# Altium schematic sheet MCU.SchDoc
size A; SheetNumber: 2; SheetTotal: 8
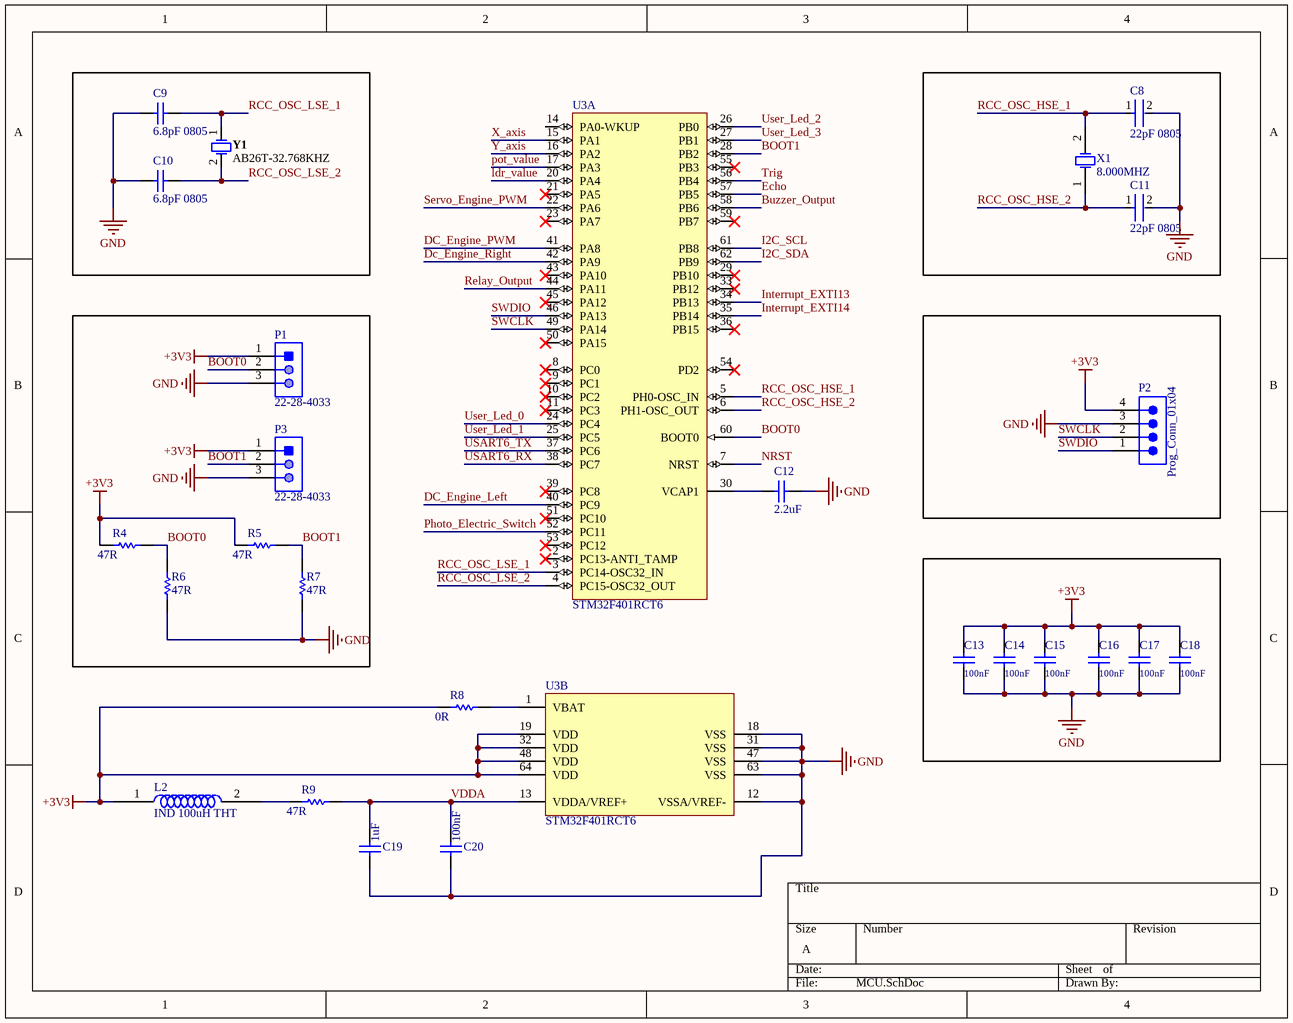
[diagram p0: MCU.SchDoc]

## Parts
C8  22pF 0805  [FP-C0805C-DN-MFG]
C9  6.8pF 0805  [CAPC0805(2012)75_N]
C10  6.8pF 0805  [CAPC0805(2012)75_N]
C11  22pF 0805  [FP-C0805C-DN-MFG]
C12  value 2.2uF  [CAPC2013X135X45LL10T25]  (hidden comment: GRM21BR71H105KA12L)
C13  value 100nF  [CAPC2013X135X45LL10T25]  (hidden comment: GRM21BR71H105KA12L)
C14  value 100nF  [CAPC2013X135X45LL10T25]  (hidden comment: GRM21BR71H105KA12L)
C15  value 100nF  [CAPC2013X135X45LL10T25]  (hidden comment: GRM21BR71H105KA12L)
C16  value 100nF  [CAPC2013X135X45LL10T25]  (hidden comment: GRM21BR71H105KA12L)
C17  value 100nF  [CAPC2013X135X45LL10T25]  (hidden comment: GRM21BR71H105KA12L)
C18  value 100nF  [CAPC2013X135X45LL10T25]  (hidden comment: GRM21BR71H105KA12L)
C19  value 1uF  [CAPC2013X135X45LL10T25]  (hidden comment: GRM21BR71H105KA12L)
C20  value 100nF  [CAPC2013X135X45LL10T25]  (hidden comment: GRM21BR71H105KA12L)
L2  IND 100uH THT  [INDUCTOR THT]
P1  22-28-4033  [MOLX-22-28-4033_V]
P2  Prog_Conn_01x04  [SMTC-TSW-104-08-X-S]
P3  22-28-4033  [MOLX-22-28-4033_V]
R4  value 47R  [RESC2013X70X40NL20T20]  (hidden comment: ERJ6ENF47R0V)
R5  value 47R  [RESC2013X70X40NL20T20]  (hidden comment: ERJ6ENF47R0V)
R6  value 47R  [RESC2013X70X40NL20T20]  (hidden comment: ERJ6ENF47R0V)
R7  value 47R  [RESC2013X70X40NL20T20]  (hidden comment: ERJ6ENF47R0V)
R8  value 0R  [RESC2013X70X40NL20T20]  (hidden comment: ERJ6ENF47R0V)
R9  value 47R  [RESC2013X70X40NL20T20]  (hidden comment: ERJ6ENF47R0V)
U3  STM32F401RCT6  [STM-LQFP64_N]  (parts A,B of 2)
X1  8.000MHZ  [ABRA-ABLS-14.7456MHZ-B2-T_V]
Y1  AB26T-32.768KHZ  [ABRA-AB26T]

## Nets
+3V3: C13.2 C14.2 C15.2 C16.2 C17.2 C18.2 L2.1 P1.1 P2.4 P3.1 R4.1 R5.1 R8.1 U3.19(VDD) U3.32(VDD) U3.48(VDD) U3.64(VDD)
GND: C8.2 C9.1 C10.1 C11.2 C12.1 C13.1 C14.1 C15.1 C16.1 C17.1 C18.1 C19.1 C20.1 P1.3 P2.3 P3.3 R6.1 R7.1 U3.12(VSSA/VREF-) U3.18(VSS) U3.31(VSS) U3.47(VSS) U3.63(VSS)
BOOT0: P1.2 R4.2 R6.2 U3.60(BOOT0)
BOOT1: P3.2 R5.2 R7.2 U3.28(PB2)
Buzzer_Output: U3.58(PB6)
DC_Engine_Left: U3.40(PC9)
DC_Engine_PWM: U3.41(PA8)
Dc_Engine_Right: U3.42(PA9)
Echo: U3.57(PB5)
I2C_SCL: U3.61(PB8)
I2C_SDA: U3.62(PB9)
Interrupt_EXTI13: U3.34(PB13)
Interrupt_EXTI14: U3.35(PB14)
ldr_value: U3.20(PA4)
NRST: U3.7(NRST)
Photo_Electric_Switch: U3.52(PC11)
pot_value: U3.17(PA3)
RCC_OSC_HSE_1: C8.1 U3.5(PH0-OSC_IN) X1.2(X2)
RCC_OSC_HSE_2: C11.1 U3.6(PH1-OSC_OUT) X1.1(X1)
RCC_OSC_LSE_1: C9.2 U3.3(PC14-OSC32_IN) Y1.1
RCC_OSC_LSE_2: C10.2 U3.4(PC15-OSC32_OUT) Y1.2
Relay_Output: U3.44(PA11)
Servo_Engine_PWM: U3.22(PA6)
SWCLK: P2.2 U3.49(PA14)
SWDIO: P2.1 U3.46(PA13)
Trig: U3.56(PB4)
USART6_RX: U3.38(PC7)
USART6_TX: U3.37(PC6)
User_Led_0: U3.24(PC4)
User_Led_1: U3.25(PC5)
User_Led_2: U3.26(PB0)
User_Led_3: U3.27(PB1)
VDDA: C19.2 C20.2 R9.2 U3.13(VDDA/VREF+)
X_axis: U3.15(PA1)
Y_axis: U3.16(PA2)
NetC12_2: C12.2 U3.30(VCAP1)
NetL2_2: L2.2 R9.1
NetR8_2: R8.2 U3.1(VBAT)

Not connected (* = marked no-connect by the designer): U3 2(PC13-ANTI_TAMP)* 8(PC0)* 9(PC1)* 10(PC2)* 11(PC3)* 14(PA0-WKUP) 21(PA5)* 23(PA7)* 29(PB10)* 33(PB12)* 36(PB15)* 39(PC8)* 43(PA10)* 45(PA12)* 50(PA15)* 51(PC10)* 53(PC12)* 54(PD2)* 55(PB3)* 59(PB7)*

## Library data of the parts
C8 C11 = CMP-2007-00466-2: CAP CER 22PF 50V 10% NP0 0805; Manufacturer Part Number: C0805C220K5GACTU; Manufacturer: KEMET; Material: Ceramic; Tolerance: 0.1; Temperature Coefficient: 30ppm/°C; Temperature Characteristic: C0G; Lead Free: Yes; Device Class L2: Capacitors; Voltage Rating: 50 V; Package: C0805C-DN; Mouser Description: Multilayer Ceramic Capacitors MLCC - SMD/SMT 50volts 22pF C0G 10%; ComponentLink2URL: https://content.kemet.com/datasheets/KEM_C1003_C0G_SMD.pdf; Ipc Land Pattern Name: CAPC200125X78; Capacitance: 22 pF; Temperature Range Low: -55°C; Device Class L1: Passive Components; Octopart: https://octopart.com/c0805c220k5gactu-kemet-9138623; ComponentLink2Description: Datasheet; Device Class L3: Ceramic Capacitors; Temperature Range High: +125°C; Height: 0.88mm; RoHS: TRUE; Temperature: -55°C to +125°C; Category: Cap; Automotive: No; Digikey Description: CAP CER 22PF 50V 10% NP0 0805; Value: 22 pF
C9 C10 = CMP-1036-00687-1: CAP 6.8pF 25V ±0.25pF 0805 (2012 Metric) Thickness 0.75mm SMD; Tolerance: Â±0.25pF; Case-EIA: 0805; Case-Metric: 2012; Value: 6.8pF; Technology: SMT; Max Thickness: 0.75 mm; Rated Voltage: 25 V
C12-C20 = CMP-1036-04761-2: Manufacturer: Murata; Part Number: GRM21BR71H105KA12L
L2 = IND 100uH THT: Fixed Ind 100uH THT
P1 P3 = CMP-1676-00001-5: Male Header, Pitch 2.54 mm, 1 x 3 Position, Height 8.38 mm, Tail Length 3.18 mm, RoHS, Bulk; Manufacturer: Molex; Rows: 1; Voltage Rating: 250 V; Current Rating: 4 A; Min Operating Temperature: 0 degC; Lead Pitch: 0.1 inch; Packaging: Bulk; Contact Finish: Gold; RoHSCompliant: true; Contact Material: Brass; PackageReference: 22-28-4033; REACH SVHC: Unknown; PackageDescription: Male Header, Pitch 2.54 mm, 1 x 3 Position, Height 8.38 mm, Tail Length 3.18 mm; ComponentLink2URL: http://www.molex.com/pdm_docs/sd/022284033_sd.pdf; Height: 8.38 mm; Mounting Technology: Through Hole; ComponentLink1Description: Manufacturer URL; Length: 7.62 mm; Mount: Through Hole; DatasheetVersion: Rev. G, 01/2012; Max Operating Temperature: 75 degC; ComponentLink2Description: Datasheet; Colour: Black; Pins: 3; Contact Plating: Gold; Package Quantity: 1; ComponentLink1URL: http://www.molex.com/
P2 = CMP-1024-00356-1: 0.025" SQ Post Header, Through-hole, Vertical, -55 to 105 degC, 2.54 mm Pitch, 4-Pin, Male, RoHS; PartNumber: TSW-104-08-T-S; Manufacturer: Samtec; Pitch: 2.54 mm; PackageDescription: .025[0.64] SQ. Post Terminal Strip Assembly; ComponentLink2URL: http://www.samtec.com/documents/webfiles/pdf/TSW_TH.PDF; ComponentLink3URL: http://www.samtec.com/documents/webfiles/cpdf/TSW-XXX-XX-XXX-X-XX-XXX-MKT.pdf; PackageVersion: DM, 8/1988; ComponentLink3Description: Package Specification; DatasheetVersion: F-214; Orientation: Vertical; RoHS: True; Mounting Technology: Through-hole; ComponentLink1URL: http://www.samtec.com; ComponentLink1Description: Manufacturer URL; Temperature Range: -55 to 105 degC; ComponentLink2Description: Datasheet; PackageReference: TSW-104-08-X-S
R4-R9 = CMP-2001-00205-1: Manufacturer: Panasonic; Part Number: ERJ6ENF47R0V
U3 = CMP-0243-00091-2: ARM Cortex-M4 32-bit MCU+FPU, 105 DMIPS, 256 kB Flash, 64 kB Internal RAM, 48 I/Os, 64-pin LQFP, -40 to 85 degC, Tray; Manufacturer: STMicroelectronics; Internal RAM Size (kB): 64; Supply Voltage(Vcc) max (V): 3.6; FLASH Size (Prog) (kB): 256; I/Os (High Current): 48; Operating Frequency(F) (Processor speed) (MHz): 84; Supply Voltage(Vcc) min (V): 1.8; DatasheetVersion: Rev. 1; ComponentLink1URL: http://www.st.com/web/en/home.html; ComponentLink1Description: Manufacturer URL; PackageDescription: 64-Pin Low Profile Quad Flat Package, 10 x 10 mm Body, 0.5 mm Pitch; Packing: Tray; ComponentLink3URL: http://www.st.com/st-web-ui/static/active/en/resource/technical/document/datasheet/DM00037051.pdf; PackageVersion: Rev. 4, 06/2013; ComponentLink2URL: http://www.st.com/st-web-ui/static/active/en/resource/technical/document/data_brief/DM00071938.pdf; PartNumber: STM32F401RCT6; PackageReference: LQFP64; Mounting Technology: Surface Mount; ComponentLink2Description: Datasheet; ComponentLink3Description: Package Specification; Core: ARM Cortex-M4
X1 = CMP-2000-05726-1: Low Profile Crystal, 8.0 MHz, +/- 30 ppm, -20 to 70 degC, 2-Pin SMD, RoHS, Tape and Reel; Brand: ABRACON; Case Length: 11.4mm; Frequency Stability: 50PPM; ESR: 80Ohms; Case Height: 4.2mm; Tolerance: 30PPM; Frequency: 8MHz; Case Width: 4.7mm; Load Capacitance: 18pF; Datasheet Version: 04/2011; Termination Style: SMD/SMT; Dimensions: 4.7mmWx11.4mmLx4.2mmH; Packaging: Reel; Manufacturer: ABRACON; Package URL: http://www.abracon.com/Support/PackageDrawing/Resonators/ABLS-2D.pdf; Mounting Technology: SurfaceMount; Package Reference: ABLS-14.7456MHZ-B2-T; Product Category: Crystals; Package Description: 2-Pin Surface Mount Device, Body 11.4 x 4.7 mm; Package / Case: HC-49/US; Mounting Style: SMD/SMT; Operating Temperature Range: -20Cto+70C; Series: ABLS; Factory Pack Quantity: 1000; Datasheet URL: http://www.abracon.com/Resonators/abls.pdf; Manufacturer URL: http://www.abracon.com/; RoHS: Details; Type: LowProfileMicroprocessorCrystal
Y1 = CMP-2000-05723-1: Crystal, 12.5 pF, 32.768 KHz, -10 to 60 degC, 2-Pin THD, RoHS, Bulk; Manufacturer: ABRACON; ESR: 35kOhms; Frequency Stability: -0.034PPM; Load Capacitance: 12.5pF; Tolerance: 20PPM; Case Length: 6.2mm; Case Diameter: 2.1mm; RoHS: Details; Product Category: Crystals; Type: WatchCrystal; Manufacturer URL: http://www.abracon.com/; Operating Temperature Range: -10Cto+60C; Package Description: 2-Pin Through Hole Device, Dia 2.1 mm, Body Length 6.2 mm; Termination Style: Radial; Datasheet Version: 06/2010; Datasheet URL: http://www.abracon.com/Resonators/AB26T.pdf; Packaging: Bulk; Factory Pack Quantity: 500; Brand: ABRACON; Mounting Technology: ThroughHole; Package URL: http://www.abracon.com/Support/PackageDrawing/Resonators/AB26T.PDF; Package / Case: Cylinder; Lead Spacing: 0.8mm; Dimensions: 2.1mmDia.x6.2mmL; Mounting Style: ThroughHole; Frequency: 32.768kHz; Package Reference: AB26T; Series: AB26T